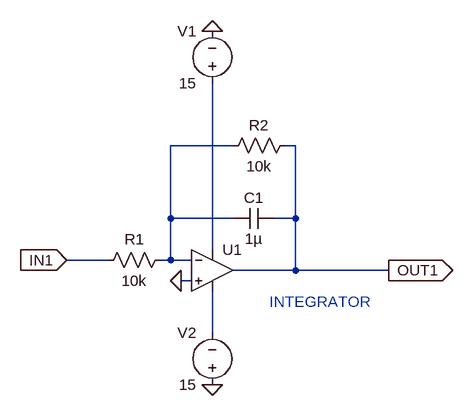
[diagram p0: schematic integratorblock.asc]
integratorblock.asc, the LTspice schematic file:
Version 4.1
SHEET 1 880 680
WIRE 272 -32 176 -32
WIRE 368 -32 352 -32
WIRE 176 80 176 -32
WIRE 272 80 176 80
WIRE 368 80 368 -32
WIRE 368 80 336 80
WIRE 240 128 240 -128
WIRE 80 144 16 144
WIRE 176 144 176 80
WIRE 176 144 160 144
WIRE 208 144 176 144
WIRE 368 160 368 80
WIRE 368 160 272 160
WIRE 512 160 368 160
WIRE 208 176 192 176
WIRE 240 256 240 192
FLAG 240 -208 0
FLAG 240 336 0
FLAG 192 176 0
FLAG 16 144 IN1
IOPIN 16 144 In
FLAG 512 160 OUT1
IOPIN 512 160 Out
SYMBOL OpAmps\\UniversalOpAmp 240 160 R0
SYMATTR InstName U1
SYMBOL voltage 240 -112 R180
WINDOW 0 24 96 Left 2
WINDOW 3 24 16 Left 2
WINDOW 123 0 0 Left 0
WINDOW 39 0 0 Left 0
SYMATTR InstName V1
SYMATTR Value 15
SYMBOL voltage 240 352 R180
WINDOW 0 24 96 Left 2
WINDOW 3 24 16 Left 2
WINDOW 123 0 0 Left 0
WINDOW 39 0 0 Left 0
SYMATTR InstName V2
SYMATTR Value 15
SYMBOL res 176 128 R90
WINDOW 0 0 56 VBottom 2
WINDOW 3 32 56 VTop 2
SYMATTR InstName R1
SYMATTR Value 10k
SYMBOL cap 336 64 R90
WINDOW 0 0 32 VBottom 2
WINDOW 3 32 32 VTop 2
SYMATTR InstName C1
SYMATTR Value 1µ
SYMBOL res 368 -48 R90
WINDOW 0 0 56 VBottom 2
WINDOW 3 32 56 VTop 2
SYMATTR InstName R2
SYMATTR Value 10k
TEXT 328 208 Left 2 ;INTEGRATOR

The netlist it stands for:
* integratorblock.asc
X§U1 0 N001 N002 N003 OUT1 level1 Avol=1Meg GBW=10Meg Vos=0 En=0 Enk=0 In=0 Ink=0 Rin=500Meg  ; pins In+ In- V+ V- OUT
V1 N002 0 15
V2 0 N003 15
R1 N001 IN1 10k
C1 OUT1 N001 1µ
R2 OUT1 N001 10k
* INTEGRATOR
.lib UniversalOpAmp1.lib
.backanno
.end